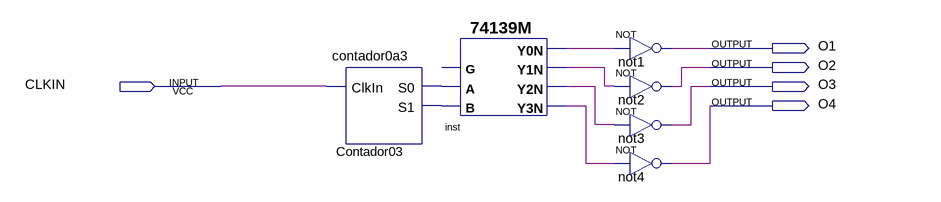
[diagram p0: schematic sheet]
// Quartus schematic Seletor.bdf as structural Verilog: 6 symbols, 5 pins
module Seletor (
  input  CLKIN,
  output O1,
  output O2,
  output O3,
  output O4
);

  wire Contador03_s0, Contador03_s1, inst_y0n, inst_y1n, inst_y2n, inst_y3n;

  contador0a3 Contador03 (.ClkIn(CLKIN), .S0(Contador03_s0), .S1(Contador03_s1));
  \74139M  inst (
    .B(Contador03_s1), .A(Contador03_s0), .Y3N(inst_y3n), .Y2N(inst_y2n), .Y0N(inst_y0n), .Y1N(inst_y1n));  // open: G
  not not1 (O1, inst_y0n);
  not not2 (O2, inst_y1n);
  not not3 (O3, inst_y2n);
  not not4 (O4, inst_y3n);
endmodule
